# Altium schematic sheet Supply Lines.SchDoc
size A; SheetNumber: 1; SheetTotal: 3
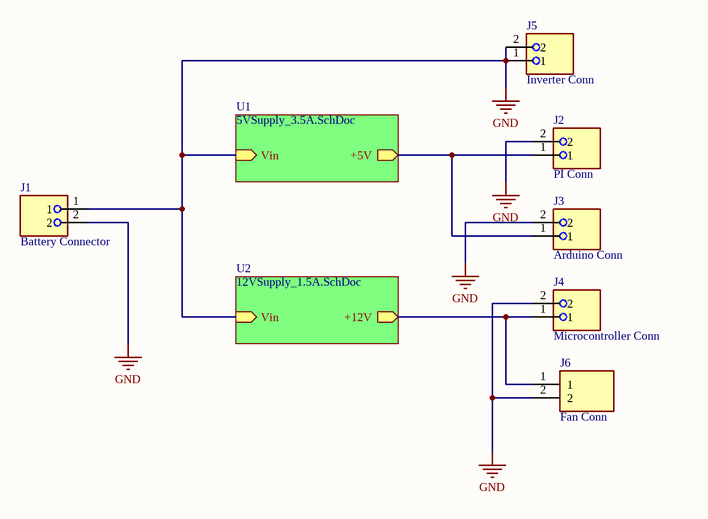
[diagram p0: Supply Lines.SchDoc]

## Parts
J1  Battery Connector  [PHOENIX_1902547]
J2  PI Conn  [PHOENIX_1902547]
J3  Arduino Conn  [PHOENIX_1902547]
J4  Microcontroller Conn  [PHOENIX_1902547]
J5  Inverter Conn  [PHOENIX_1902547]
J6  Fan Conn  [1935776]

## Sub-sheets
U1 = 5VSupply_3.5A.SchDoc: Vin (in), +5V (out)
U2 = 12VSupply_1.5A.SchDoc: Vin (in), +12V (out)

## Nets
GND: J1.1 J1.2 J2.2 J3.2 J4.2 J5.1 J5.2 J6.2 ; sheet U1/Vin, sheet U2/Vin
NetJ2_1: J2.1 J3.1 ; sheet U1/+5V
NetJ4_1: J4.1 J6.1 ; sheet U2/+12V

## Library data of the parts
J1-J5 = 1902547: Conn PC Terminal Block 2 POS 9.52mm Solder ST Thru-Hole 32A Cardboard; Manufacturer: Phoenix Contact; Approvals: CSA, UL; Current: 30A; Gender: Male; Number of Circuits: 2; Number of Levels: 1; Voltage: 600V; Voltage Rating: 800V; Wire/Cable Gauge: 10AWG; Wire Gauge (Max): 30AWG; Supplier: DigiKey; Supplier Part Number: 277-5951-ND; Manufacturer Part Number: 1902547; RoHS: Compliant; Category: Terminal Blocks; Stock: 2575; Pricing: 1=2.05, 10=1.543, 25=1.2168 (USD); China RoHS: Compliant; Color: Green; Contact Material: Tin; Current Rating: 32A; Depth: 21.5mm; Flammability Rating: UL94 V-0; Height: 21.5mm; Housing Color: Green; Housing Material: Polyamide; Lead Free: Lead Free; Length: 19.04mm; Lifecycle Status: Production; Material: Polyamide; Max Current Rating: 32A; Mounting Technology: Screw; Number of Contacts: 2; Pins: 2; Number of Poles: 2; Number of Positions: 2; Number of Positions Per Level: 2; Number of Rows: 1; Orientation: Straight; Pitch: 9.52mm; REACH SVHC: Yes; Termination: Screw; Weight: 6.719999g; Width: 16mm; Wire Gauge (Min): 10AWG; ComponentLink1URL: https://datasheet.octopart.com:443/1902547-Phoenix-Contact-datasheet-86450925.pdf?src-supplier=Farnell; ComponentLink1Description: https://datasheet.octopart.com:443/1902547-Phoenix-Contact-datasheet-86450925.pdf?src-supplier=Farnell; ComponentLink2URL: https://datasheet.octopart.com:443/MKDS-5-HV--2-9%2C52-Phoenix-Contact-datasheet-58098511.pdf?src-supplier=element14+APAC; ComponentLink2Description: https://datasheet.octopart.com:443/MKDS-5-HV--2-9%2C52-Phoenix-Contact-datasheet-58098511.pdf?src-supplier=element14+APAC; ComponentLink3URL: https://datasheet.octopart.com:443/1902547-Phoenix-Contact-datasheet-154783129.pdf?src-supplier=Electro+Sonic; ComponentLink3Description: https://datasheet.octopart.com:443/1902547-Phoenix-Contact-datasheet-154783129.pdf?src-supplier=Electro+Sonic; ComponentLink4URL: https://datasheet.octopart.com:443/1902547-Phoenix-Contact-datasheet-177362804.pdf?src-supplier=Burklin+Elektronik; ComponentLink4Description: https://datasheet.octopart.com:443/1902547-Phoenix-Contact-datasheet-177362804.pdf?src-supplier=Burklin+Elektronik; ComponentLink5URL: https://datasheet.octopart.com:443/1902547-Phoenix-Contact-datasheet-13545994.pdf?src-supplier=RS+(Formerly+Allied+Electronics); ComponentLink5Description: https://datasheet.octopart.com:443/1902547-Phoenix-Contact-datasheet-13545994.pdf?src-supplier=RS+(Formerly+Allied+Electronics); ComponentLink6URL: https://datasheet.octopart.com:443/1902547-Phoenix-Contact-datasheet-62122993.pdf?src-supplier=RS+(Formerly+Allied+Electronics); ComponentLink6Description: https://datasheet.octopart.com:443/1902547-Phoenix-Contact-datasheet-62122993.pdf?src-supplier=RS+(Formerly+Allied+Electronics); ComponentLink7URL: https://datasheet.octopart.com:443/1902547-Phoenix-Contact-datasheet-33514357.pdf?src-supplier=MRO+Stop; ComponentLink7Description: https://datasheet.octopart.com:443/1902547-Phoenix-Contact-datasheet-33514357.pdf?src-supplier=MRO+Stop; ComponentLink8URL: https://datasheet.octopart.com:443/1902547-Phoenix-Contact-datasheet-11802246.pdf?src-supplier=Arrow+Electronics; ComponentLink8Description: https://datasheet.octopart.com:443/1902547-Phoenix-Contact-datasheet-11802246.pdf?src-supplier=Arrow+Electronics
J6 = 1935776: Conn Terminal Block 2 POS 5mm Solder ST Thru-Hole 32ACardboard; Manufacturer: Phoenix Contact; Approvals: UL; Current: 20A; Current Rating: 32A; Max Supply Voltage: 250V; Number of Circuits: 2; Number of Levels: 1; Voltage: 300V; Wire/Cable Gauge: 10AWG; Wire Gauge (Max): 20AWG; Wire Gauge (Min): 12AWG; Supplier: Mouser; Supplier Part Number: 651-1935776; Manufacturer Part Number: 1935776; RoHS: Compliant; Category: Terminal Blocks; Stock: 3159; Pricing: 1=0.81, 10=0.593, 50=0.479, 100=0.47, 1000=0.47, 10000=0.47 (USD); China RoHS: Non-Compliant; Color: Green; Contact Material: Tin; Depth: 9mm; Height: 13.5mm; Housing Color: Green; Housing Material: Polyamide; Lead Free: Lead Free; Length: 9mm; Lifecycle Status: Production; Material: Nylon; Max Current Rating: 32A; Mounting Technology: Screw; Number of Contacts: 2; Pins: 2; Number of Poles: 2; Number of Positions: 2; Number of Positions Per Level: 2; Number of Rows: 1; Orientation: Straight; Packaging: Bulk; Pitch: 5mm; Radiation Hardening: No; REACH SVHC: No; Termination: Solder; Voltage Rating: 250V; Weight: 2.42g; Width: 17.6mm; ComponentLink1URL: https://datasheet.octopart.com:443/1935776-Phoenix-Contact-datasheet-154783799.pdf?src-supplier=Electro+Sonic; ComponentLink1Description: https://datasheet.octopart.com:443/1935776-Phoenix-Contact-datasheet-154783799.pdf?src-supplier=Electro+Sonic; ComponentLink2URL: https://datasheet.octopart.com:443/1935776-Phoenix-Contact-datasheet-33522892.pdf?src-supplier=MRO+Stop; ComponentLink2Description: https://datasheet.octopart.com:443/1935776-Phoenix-Contact-datasheet-33522892.pdf?src-supplier=MRO+Stop; ComponentLink3URL: https://datasheet.octopart.com:443/1935776-Phoenix-Contact-datasheet-140322698.pdf?src-supplier=Farnell; ComponentLink3Description: https://datasheet.octopart.com:443/1935776-Phoenix-Contact-datasheet-140322698.pdf?src-supplier=Farnell; ComponentLink4URL: https://datasheet.octopart.com:443/1935776-Phoenix-Contact-datasheet-9718601.pdf?src-supplier=RS+(Formerly+Allied+Electronics); ComponentLink4Description: https://datasheet.octopart.com:443/1935776-Phoenix-Contact-datasheet-9718601.pdf?src-supplier=RS+(Formerly+Allied+Electronics); ComponentLink5URL: https://datasheet.octopart.com:443/1935776-Phoenix-Contact-datasheet-62084812.pdf?src-supplier=RS+(Formerly+Allied+Electronics); ComponentLink5Description: https://datasheet.octopart.com:443/1935776-Phoenix-Contact-datasheet-62084812.pdf?src-supplier=RS+(Formerly+Allied+Electronics); ComponentLink6URL: https://datasheet.octopart.com:443/1935776-Phoenix-Contact-datasheet-164875068.pdf?src-supplier=Burklin+Elektronik; ComponentLink6Description: https://datasheet.octopart.com:443/1935776-Phoenix-Contact-datasheet-164875068.pdf?src-supplier=Burklin+Elektronik